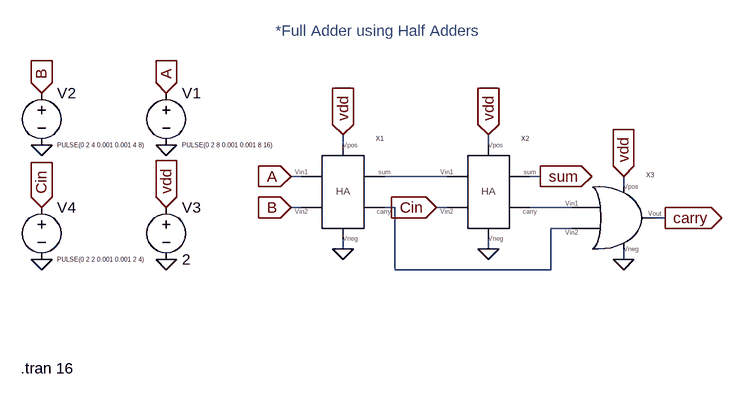
[diagram p0: schematic FA by HA blk.asc]
FA by HA blk.asc, the LTspice schematic file:
Version 4
SHEET 1 1056 680
WIRE 368 -32 368 -48
WIRE 592 -32 592 -48
WIRE 304 16 288 16
WIRE 528 16 432 16
WIRE 672 16 656 16
WIRE 800 32 800 16
WIRE 304 64 288 64
WIRE 448 64 432 64
WIRE 528 64 512 64
WIRE 720 64 656 64
WIRE 864 80 848 80
WIRE 720 96 688 96
WIRE 368 128 368 112
WIRE 592 128 592 112
WIRE 800 144 800 128
WIRE 448 160 448 64
WIRE 688 160 688 96
WIRE 688 160 448 160
FLAG 96 -112 A
IOPIN 96 -112 In
FLAG -96 -112 B
IOPIN -96 -112 In
FLAG 96 64 vdd
IOPIN 96 64 In
FLAG 96 -32 0
FLAG 96 144 0
FLAG -96 -32 0
FLAG -96 64 Cin
IOPIN -96 64 In
FLAG -96 144 0
FLAG 288 16 A
IOPIN 288 16 In
FLAG 288 64 B
IOPIN 288 64 In
FLAG 512 64 Cin
IOPIN 512 64 In
FLAG 368 128 0
FLAG 592 128 0
FLAG 800 144 0
FLAG 368 -48 vdd
IOPIN 368 -48 In
FLAG 592 -48 vdd
IOPIN 592 -48 In
FLAG 800 16 vdd
IOPIN 800 16 In
FLAG 672 16 sum
IOPIN 672 16 Out
FLAG 864 80 carry
IOPIN 864 80 Out
SYMBOL voltage 96 -128 R0
WINDOW 3 24 96 Left 0
WINDOW 123 0 0 Left 0
WINDOW 39 0 0 Left 0
SYMATTR Value PULSE(0 2 8 0.001 0.001 8 16)
SYMATTR InstName V1
SYMBOL voltage -96 -128 R0
WINDOW 3 24 96 Left 0
WINDOW 123 0 0 Left 0
WINDOW 39 0 0 Left 0
SYMATTR Value PULSE(0 2 4 0.001 0.001 4 8)
SYMATTR InstName V2
SYMBOL voltage 96 48 R0
WINDOW 123 0 0 Left 0
WINDOW 39 0 0 Left 0
SYMATTR InstName V3
SYMATTR Value 2
SYMBOL voltage -96 48 R0
WINDOW 3 24 96 Left 0
WINDOW 123 0 0 Left 0
WINDOW 39 0 0 Left 0
SYMATTR Value PULSE(0 2 2 0.001 0.001 2 4)
SYMATTR InstName V4
SYMBOL ha 384 48 R0
SYMATTR InstName X1
SYMBOL ha 608 48 R0
SYMATTR InstName X2
SYMBOL or 544 80 R0
SYMATTR InstName X3
TEXT -128 312 Left 2 !.tran 16
TEXT 264 -208 Left 2 ;*Full Adder using Half Adders

The netlist it stands for:
* FA by HA blk.asc
V1 A 0 PULSE(0 2 8 0.001 0.001 8 16)
V2 B 0 PULSE(0 2 4 0.001 0.001 4 8)
V3 vdd 0 2
V4 Cin 0 PULSE(0 2 2 0.001 0.001 2 4)
XX1 vdd A B N001 N002 0 ha  ; pins vdd A B sum carry gnd
XX2 vdd N001 Cin sum N003 0 ha  ; pins vdd A B sum carry gnd
XX3 vdd N003 N002 0 carry or  ; pins vdd A B gnd Y
.tran 16
* *Full Adder using Half Adders
.backanno
.end